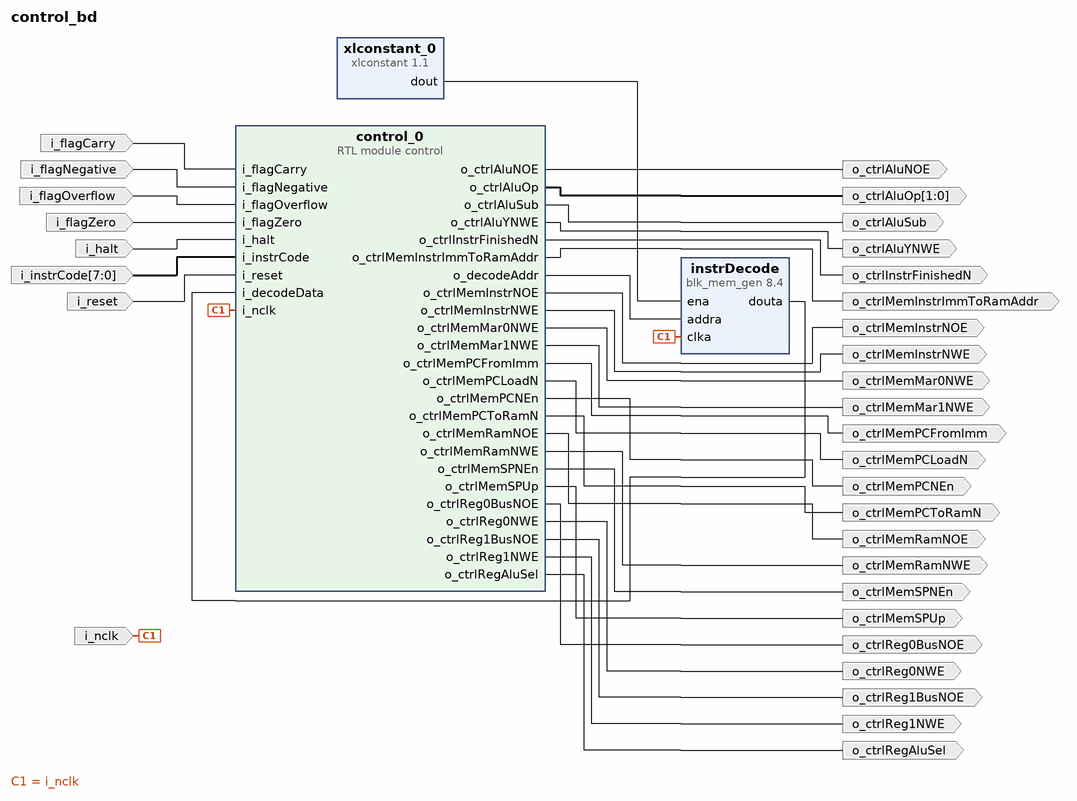
[diagram p0: block diagram of the top level]
# Vivado block design control_bd, xc7a100tcsg324-3, Vivado 2021.1
create_bd_design control_bd

create_bd_port -dir I i_flagNegative
create_bd_port -dir I -from 7 -to 0 i_instrCode
create_bd_port -dir I -type rst i_reset
create_bd_port -dir O o_ctrlAluNOE
create_bd_port -dir O -from 1 -to 0 o_ctrlAluOp
create_bd_port -dir O o_ctrlAluSub
create_bd_port -dir O o_ctrlAluYNWE
create_bd_port -dir O o_ctrlMemInstrNOE
create_bd_port -dir O o_ctrlMemInstrNWE
create_bd_port -dir O o_ctrlMemMar0NWE
create_bd_port -dir O o_ctrlMemMar1NWE
create_bd_port -dir O o_ctrlMemPCLoadN
create_bd_port -dir O o_ctrlMemRamNOE
create_bd_port -dir O o_ctrlMemRamNWE
create_bd_port -dir O o_ctrlMemSPNEn
create_bd_port -dir O o_ctrlMemSPUp
create_bd_port -dir O o_ctrlRegAluSel
create_bd_port -dir O o_ctrlReg0NWE
create_bd_port -dir O o_ctrlReg1NWE
create_bd_port -dir I -type clk i_nclk
set_property -dict {CONFIG.FREQ_HZ 100000000} [get_bd_ports i_nclk]
create_bd_port -dir I i_flagCarry
create_bd_port -dir I i_flagOverflow
create_bd_port -dir O o_ctrlInstrFinishedN
create_bd_port -dir O o_ctrlMemPCNEn
create_bd_port -dir O o_ctrlReg0BusNOE
create_bd_port -dir O o_ctrlReg1BusNOE
create_bd_port -dir I i_halt
create_bd_port -dir O o_ctrlMemInstrImmToRamAddr
create_bd_port -dir O o_ctrlMemPCToRamN
create_bd_port -dir O o_ctrlMemPCFromImm
create_bd_port -dir I i_flagZero

create_bd_cell -type ip -vlnv xilinx.com:ip:blk_mem_gen:8.4 instrDecode
set_property -dict [list \
  CONFIG.Coe_File ../../../../../../../microCodeRom.coe \
  CONFIG.Enable_32bit_Address false \
  CONFIG.Enable_A Use_ENA_Pin \
  CONFIG.Fill_Remaining_Memory_Locations false \
  CONFIG.Load_Init_File true \
  CONFIG.Memory_Type Single_Port_ROM \
  CONFIG.Port_A_Write_Rate 0 \
  CONFIG.Register_PortA_Output_of_Memory_Primitives false \
  CONFIG.Use_RSTA_Pin false \
  CONFIG.Write_Depth_A 32768 \
  CONFIG.Write_Width_A 24 \
  CONFIG.use_bram_block Stand_Alone \
] [get_bd_cells instrDecode]
create_bd_cell -type ip -vlnv xilinx.com:ip:xlconstant:1.1 xlconstant_0
create_bd_cell -type module -reference control control_0

# ---- connections ----

connect_bd_net [get_bd_pins control_0/o_ctrlAluNOE] [get_bd_ports o_ctrlAluNOE]
connect_bd_net [get_bd_pins control_0/o_ctrlAluOp] [get_bd_ports o_ctrlAluOp]
connect_bd_net [get_bd_pins control_0/o_ctrlAluSub] [get_bd_ports o_ctrlAluSub]
connect_bd_net [get_bd_pins control_0/o_ctrlAluYNWE] [get_bd_ports o_ctrlAluYNWE]
connect_bd_net [get_bd_pins control_0/o_ctrlInstrFinishedN] [get_bd_ports o_ctrlInstrFinishedN]
connect_bd_net [get_bd_pins control_0/o_ctrlMemInstrImmToRamAddr] [get_bd_ports o_ctrlMemInstrImmToRamAddr]
connect_bd_net [get_bd_pins control_0/o_ctrlMemInstrNOE] [get_bd_ports o_ctrlMemInstrNOE]
connect_bd_net [get_bd_pins control_0/o_ctrlMemInstrNWE] [get_bd_ports o_ctrlMemInstrNWE]
connect_bd_net [get_bd_pins control_0/o_ctrlMemMar0NWE] [get_bd_ports o_ctrlMemMar0NWE]
connect_bd_net [get_bd_pins control_0/o_ctrlMemMar1NWE] [get_bd_ports o_ctrlMemMar1NWE]
connect_bd_net [get_bd_pins control_0/o_ctrlMemPCFromImm] [get_bd_ports o_ctrlMemPCFromImm]
connect_bd_net [get_bd_pins control_0/o_ctrlMemPCLoadN] [get_bd_ports o_ctrlMemPCLoadN]
connect_bd_net [get_bd_pins control_0/o_ctrlMemPCNEn] [get_bd_ports o_ctrlMemPCNEn]
connect_bd_net [get_bd_pins control_0/o_ctrlMemPCToRamN] [get_bd_ports o_ctrlMemPCToRamN]
connect_bd_net [get_bd_pins control_0/o_ctrlMemRamNOE] [get_bd_ports o_ctrlMemRamNOE]
connect_bd_net [get_bd_pins control_0/o_ctrlMemRamNWE] [get_bd_ports o_ctrlMemRamNWE]
connect_bd_net [get_bd_pins control_0/o_ctrlMemSPNEn] [get_bd_ports o_ctrlMemSPNEn]
connect_bd_net [get_bd_pins control_0/o_ctrlMemSPUp] [get_bd_ports o_ctrlMemSPUp]
connect_bd_net [get_bd_pins control_0/o_ctrlReg0BusNOE] [get_bd_ports o_ctrlReg0BusNOE]
connect_bd_net [get_bd_pins control_0/o_ctrlReg0NWE] [get_bd_ports o_ctrlReg0NWE]
connect_bd_net [get_bd_pins control_0/o_ctrlReg1BusNOE] [get_bd_ports o_ctrlReg1BusNOE]
connect_bd_net [get_bd_pins control_0/o_ctrlReg1NWE] [get_bd_ports o_ctrlReg1NWE]
connect_bd_net [get_bd_pins control_0/o_ctrlRegAluSel] [get_bd_ports o_ctrlRegAluSel]
connect_bd_net [get_bd_pins control_0/o_decodeAddr] [get_bd_pins instrDecode/addra]
connect_bd_net -net i_flagCarry_0_1 [get_bd_ports i_flagCarry] [get_bd_pins control_0/i_flagCarry]
connect_bd_net -net i_flagNegative_0_1 [get_bd_ports i_flagNegative] [get_bd_pins control_0/i_flagNegative]
connect_bd_net -net i_flagOverflow_0_1 [get_bd_ports i_flagOverflow] [get_bd_pins control_0/i_flagOverflow]
connect_bd_net -net i_flagZero_0_1 [get_bd_ports i_flagZero] [get_bd_pins control_0/i_flagZero]
connect_bd_net -net i_halt_0_1 [get_bd_ports i_halt] [get_bd_pins control_0/i_halt]
connect_bd_net -net i_instrCode_0_1 [get_bd_ports i_instrCode] [get_bd_pins control_0/i_instrCode]
connect_bd_net [get_bd_ports i_nclk] [get_bd_pins instrDecode/clka] [get_bd_pins control_0/i_nclk]
connect_bd_net -net i_reset_0_1 [get_bd_ports i_reset] [get_bd_pins control_0/i_reset]
connect_bd_net [get_bd_pins instrDecode/douta] [get_bd_pins control_0/i_decodeData]
connect_bd_net [get_bd_pins xlconstant_0/dout] [get_bd_pins instrDecode/ena]

validate_bd_design
save_bd_design
